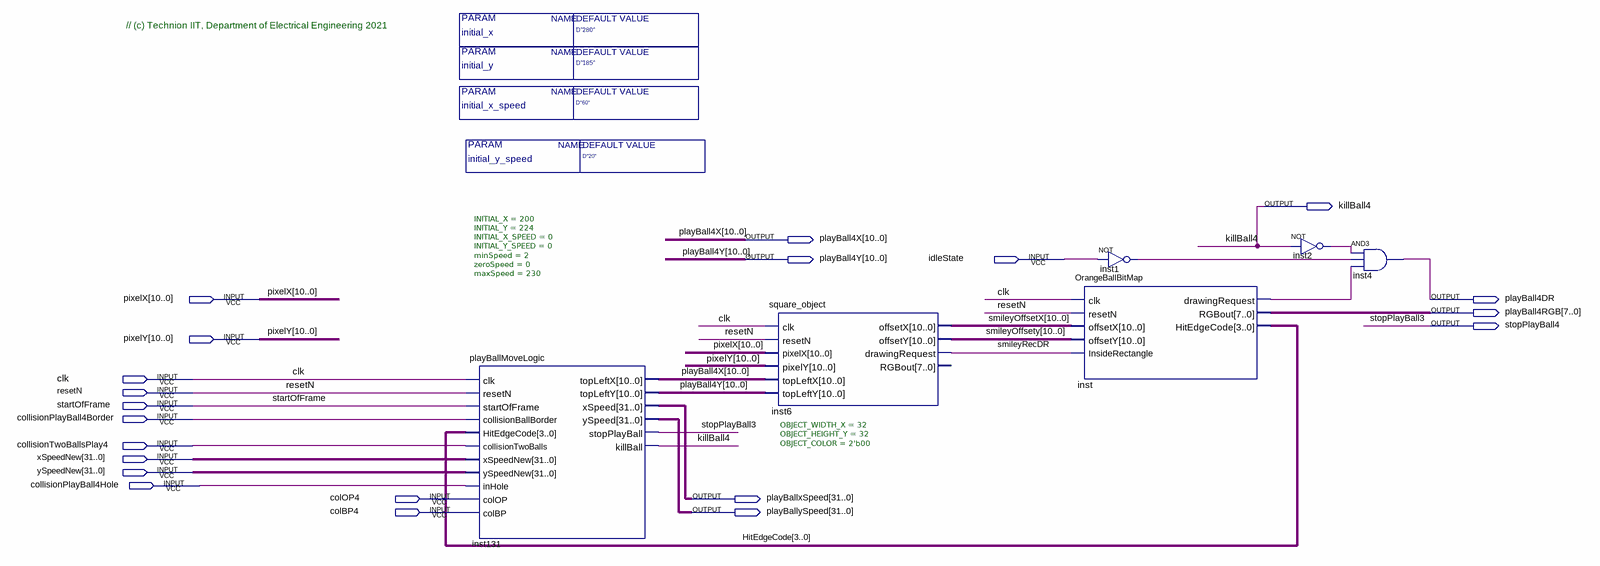
[diagram p0: schematic sheet]
// Quartus schematic playBall4Block.bdf as structural Verilog: 6 symbols, 21 pins
module playBall4Block #(parameter initial_x = "D\"280\"", parameter initial_y = "D\"185\"", parameter initial_x_speed = "D\"60\"", parameter initial_y_speed = "D\"20\"") (
  input  idleState,
  input  [10:0] pixelX,
  input  [10:0] pixelY,
  input  clk,
  input  resetN,
  input  startOfFrame,
  input  collisionPlayBall4Border,
  input  collisionTwoBallsPlay4,
  input  [31:0] xSpeedNew,
  input  [31:0] ySpeedNew,
  input  collisionPlayBall4Hole,
  input  colOP4,
  input  colBP4,
  output killBall4,
  output [10:0] playBall4X,
  output [10:0] playBall4Y,
  output playBall4DR,
  output [7:0] playBall4RGB,
  output stopPlayBall4,
  output [31:0] playBallxSpeed,
  output [31:0] playBallySpeed
);

  wire inst1_out, inst2_out, inst_drawingrequest, smileyRecDR;
  wire [3:0] HitEdgeCode;
  wire [10:0] smileyOffsetX, smileyOffsety;

  playBallMoveLogic #(.INITIAL_X(200), .INITIAL_Y(224), .INITIAL_X_SPEED(0), .INITIAL_Y_SPEED(0), .minSpeed(2), .zeroSpeed(0), .maxSpeed(230)) inst131 (
    .clk(clk), .resetN(resetN), .startOfFrame(startOfFrame), .collisionBallBorder(collisionPlayBall4Border),
    .HitEdgeCode(HitEdgeCode), .collisionTwoBalls(collisionTwoBallsPlay4), .xSpeedNew(xSpeedNew),
    .ySpeedNew(ySpeedNew), .inHole(collisionPlayBall4Hole), .colOP(colOP4), .colBP(colBP4),
    .topLeftX(playBall4X), .topLeftY(playBall4Y), .xSpeed(playBallxSpeed), .ySpeed(playBallySpeed),
    .stopPlayBall(stopPlayBall4), .killBall(killBall4));
  square_object #(.OBJECT_WIDTH_X(32), .OBJECT_HEIGHT_Y(32), .OBJECT_COLOR(2'b00)) inst6 (
    .clk(clk), .resetN(resetN), .pixelX(pixelX), .pixelY(pixelY), .topLeftX(playBall4X),
    .topLeftY(playBall4Y), .offsetX(smileyOffsetX), .offsetY(smileyOffsety), .drawingRequest(smileyRecDR));  // open: RGBout
  OrangeBallBitMap inst (
    .clk(clk), .resetN(resetN), .offsetX(smileyOffsetX), .offsetY(smileyOffsety),
    .InsideRectangle(smileyRecDR), .drawingRequest(inst_drawingrequest), .RGBout(playBall4RGB),
    .HitEdgeCode(HitEdgeCode));
  not inst1 (inst1_out, idleState);
  not inst2 (inst2_out, killBall4);
  and inst4 (playBall4DR, inst2_out, inst1_out, inst_drawingrequest);

  // Other names for the same wires on the sheet: stopPlayBall3 = stopPlayBall4

  // Notes on the sheet:
  //   // (c) Technion IIT, Department of Electrical Engineering 2021
endmodule
